# EAGLE board StaticPlatformMain_v1 (EAGLE 9.6.2)
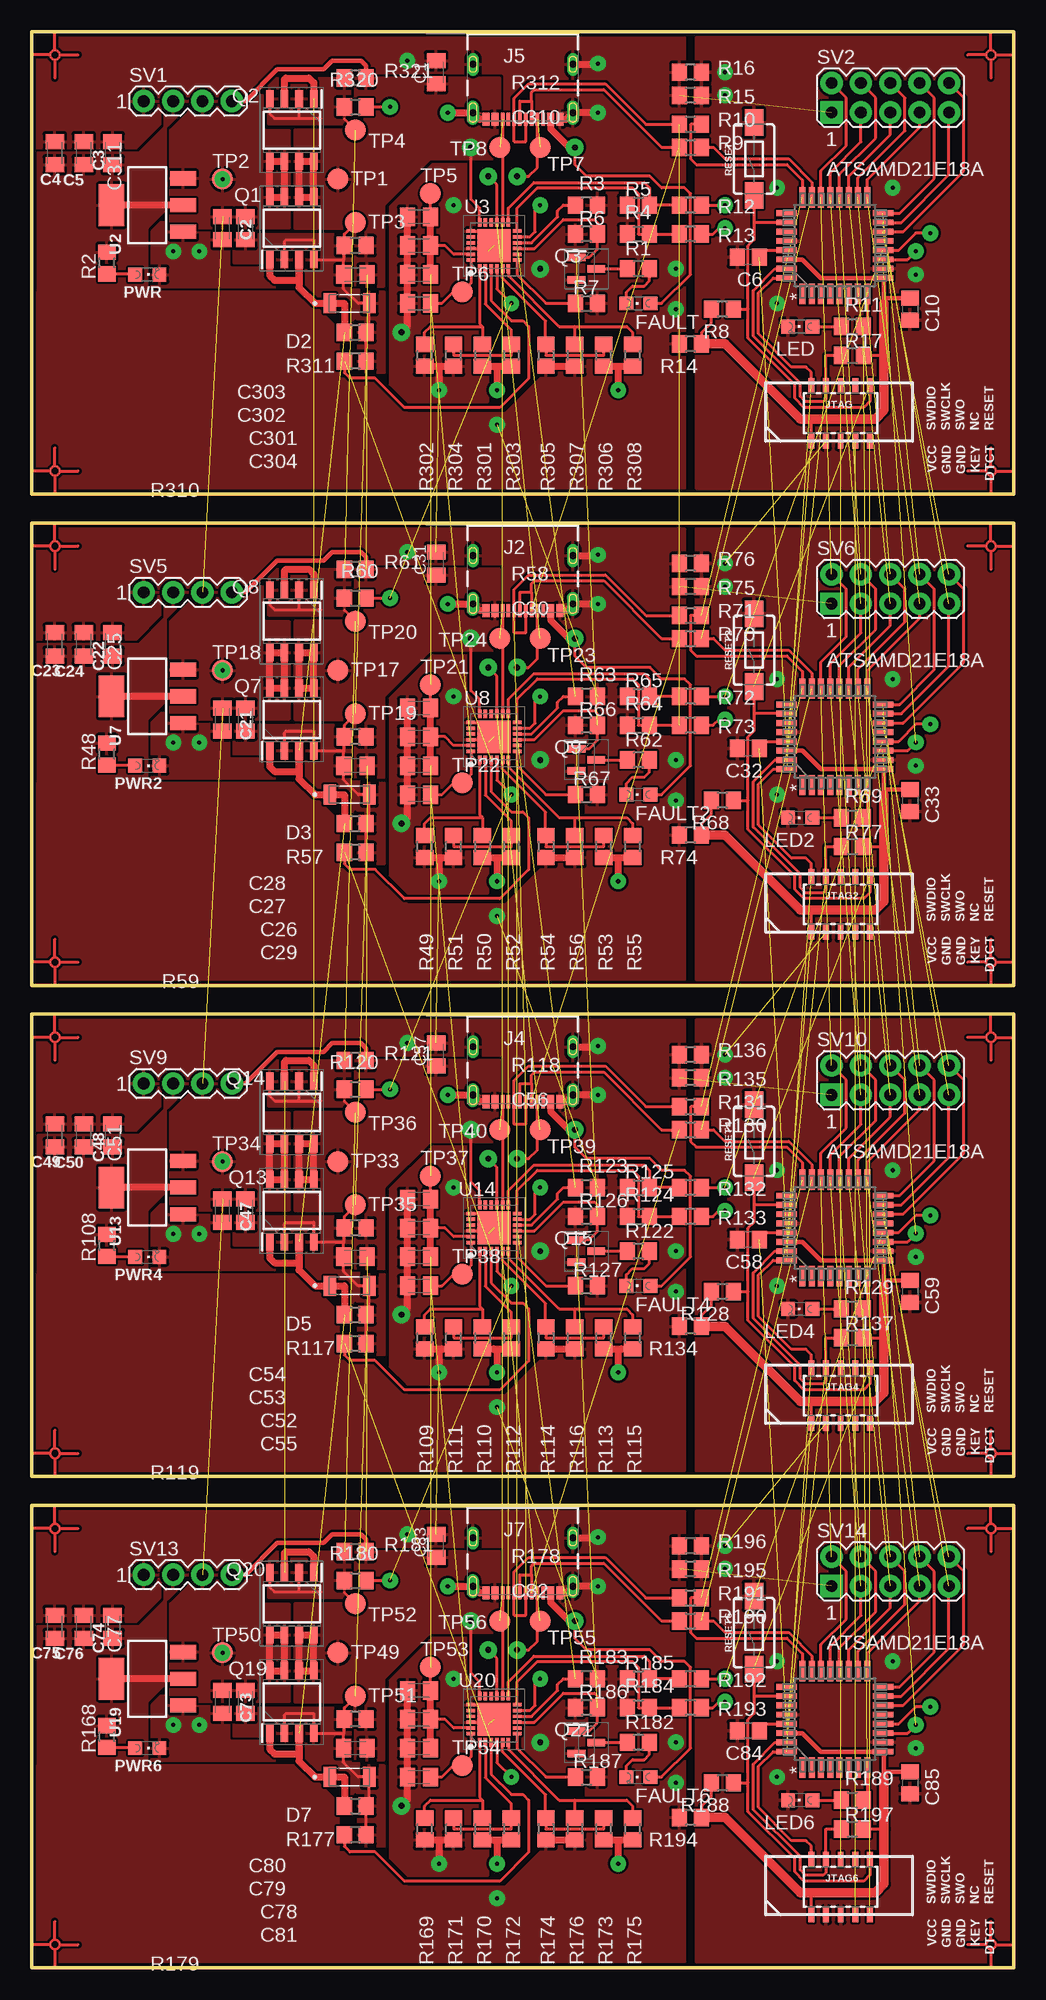
[diagram p7: board, top side]
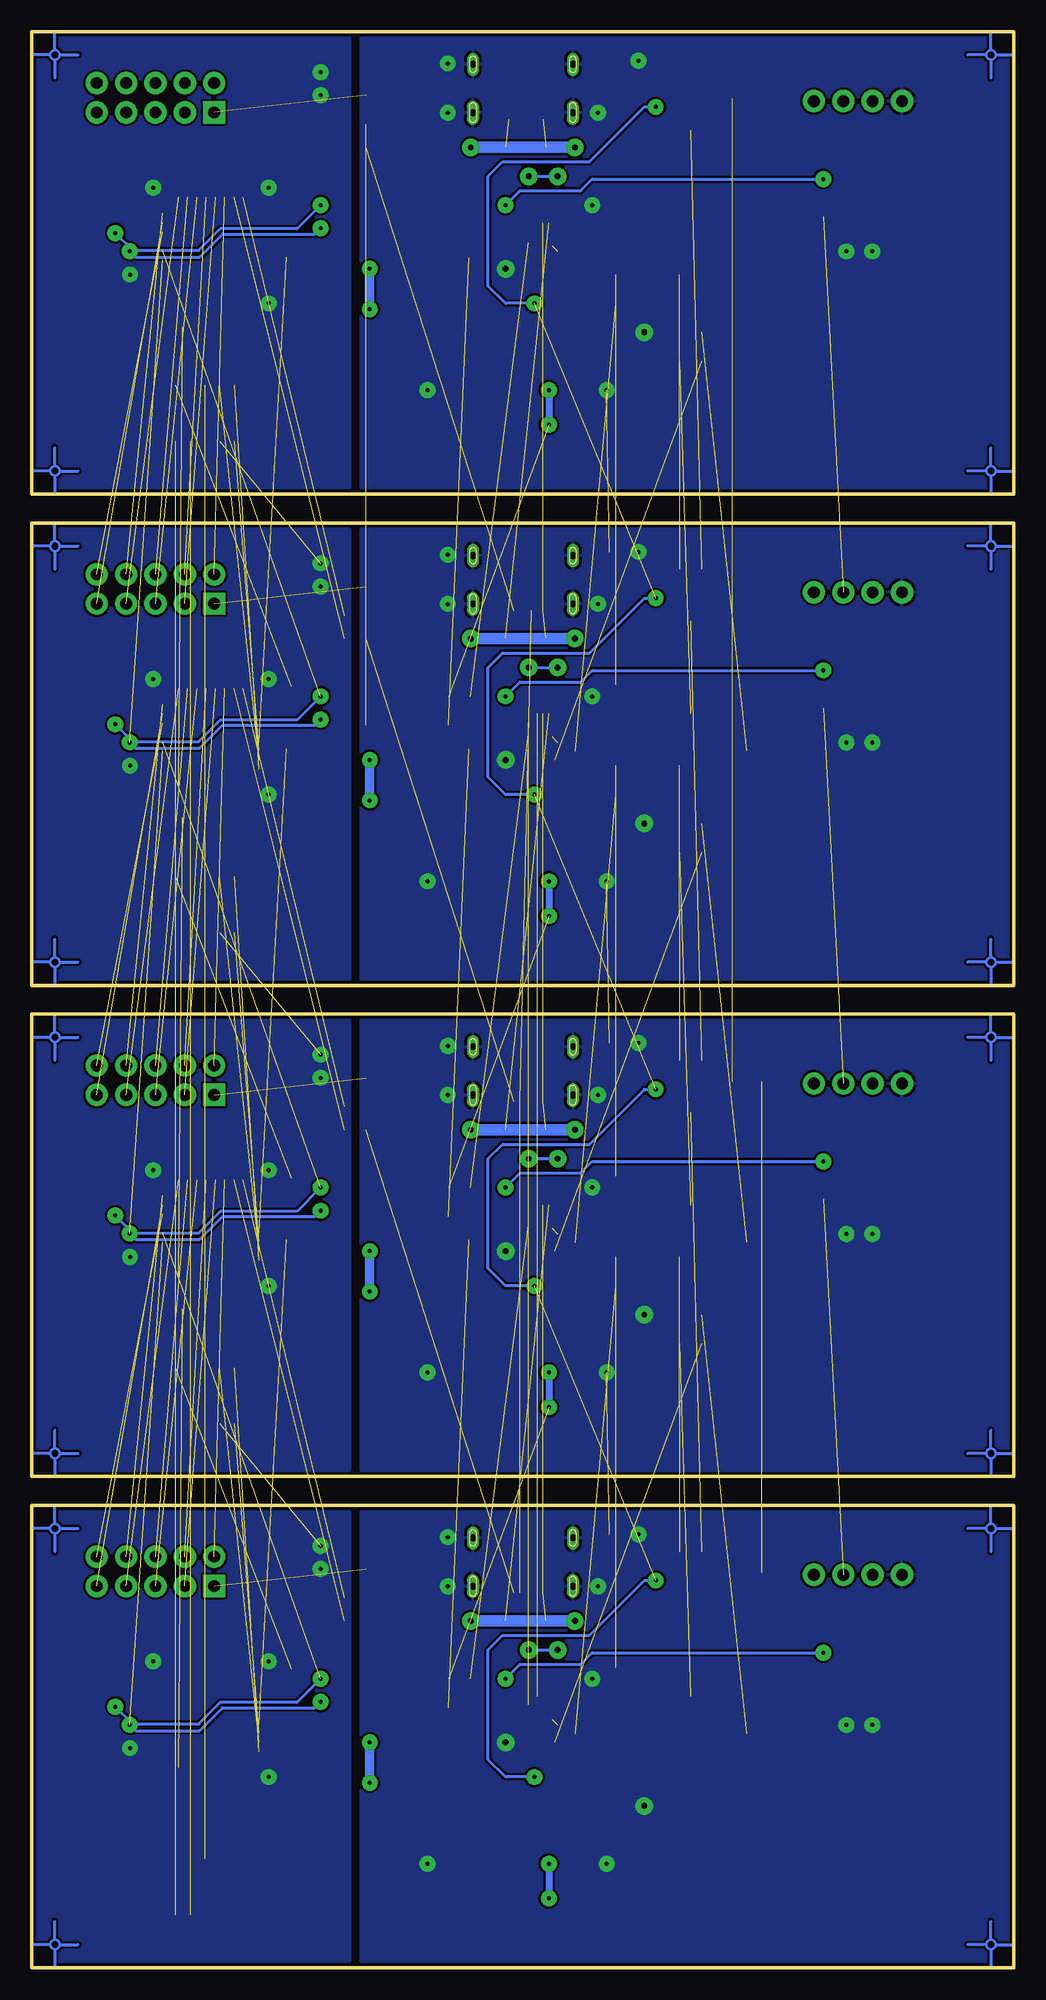
[diagram p8: board, bottom side, seen from below]

Size 85 x 167.5 mm. Coordinates in mm from the lower left corner, seen from the top.
Outline: 0,167.5 85,167.5 85,127.5 0,127.5 0,167.5
Outline: 0,125 85,125 85,85 0,85 0,125
Outline: 0,82.5 85,82.5 85,42.5 0,42.5 0,82.5
Outline: 0,40 85,40 85,0 0,0 0,40
Copper layers (1*16): Top 0.035mm / dielectric 1.5mm / Bottom 0.035mm
Design rules "default *": minimum track width 0.25mm, minimum drill 0.35mm, track to track 0.2mm, track to pad 0.2mm, pad to pad 0.2mm, via to via 0.2mm, smd to smd 0.2mm, copper to edge 0.2mm, drill to drill 0.2mm, minimum pad ring 8mil, minimum via ring 1mm, stop-mask expansion 4mil, vias tented up to drill 0mil, thermal gap 10mil
Net classes: 1 usbpair: width 0.25 mm, clearance 0.2 mm
tRestrict: 8 lines

## Footprints (pad centres in the part's own frame; a part is rotated, then mirrored left to right if it is on the bottom)
C0805K = smd 1.3 x 1.6: 1 -1,0; 2 1,0
C0805 = smd 1.3 x 1.5: 1 -0.95,0; 2 0.95,0
DIOMELF3515N = smd 1.11 x 1.73: A 1.705,0; C -1.705,0
CHIPLED_0805 = smd 1.2 x 1.2: A 0,-1.05; C 0,1.05
GCT_USB4105-GF-A = smd 0.6 x 1.15: A1_B12 -3.2,4.755; A4_B9 -2.4,4.755; B1_A12 3.2,4.755; B4_A9 2.4,4.755 | smd 0.3 x 1.15: A5 -1.25,4.755; A6 -0.25,4.755; A7 0.25,4.755; A8 1.25,4.755; B5 1.75,4.755; B6 0.75,4.755; B7 -0.75,4.755; B8 -1.75,4.755 | drill 0.6 pad 1.05 long: S1 -4.32,4.18; S4 4.32,4.18 | drill 0.6 pad 1 long: S2 -4.32,0; S3 4.32,0
SAMTECH_FTSH-105-01 = smd 0.508 x 1.27: 1 -2.54,-2.413; 2 -2.54,2.413; 3 -1.27,-2.413; 4 -1.27,2.413; 5 0,-2.413; 6 0,2.413; 7 1.27,-2.413; 8 1.27,2.413; 9 2.54,-2.413; 10 2.54,2.413
SOIC127P600X175-8N = smd 1.5 x 0.65: 1 -2.7,1.905; 2 -2.7,0.635; 3 -2.7,-0.635; 4 -2.7,-1.905; 5 2.7,-1.905; 6 2.7,-0.635; 7 2.7,0.635; 8 2.7,1.905
SOT96P240X120-3N = smd 1.55 x 0.65: 1 -0.85,0.96; 2 -0.85,-0.96; 3 0.85,0
R0805 = smd 1.3 x 1.5: 1 -0.95,0; 2 0.95,0
TACTILE_SWITCH_SMD_6.0X3.5MM = smd 2.3 x 1.6: 1 -3.15,0; 2 3.15,0
MA04-1 = drill 1.016 pad 1.93: 1 -3.81,0; 2 -1.27,0; 3 1.27,0; 4 3.81,0
MA05-2 = drill 1.016 pad 1.93 square: 1 -5.08,-1.27 | drill 1.016 pad 1.93: 2 -5.08,1.27; 3 -2.54,-1.27; 4 -2.54,1.27; 5 0,-1.27; 6 0,1.27; 7 2.54,-1.27; 8 2.54,1.27; 9 5.08,-1.27; 10 5.08,1.27
TP18R = smd 1.8 x 1.8: TP 0,0
TQFP32_MC_MCH-M = smd 1.762 x 0.507: 1 -4.169,2.8; 2 -4.169,2; 3 -4.169,1.2; 4 -4.169,0.4; 5 -4.169,-0.4; 6 -4.169,-1.2; 7 -4.169,-2; 8 -4.169,-2.8; 17 4.169,-2.8; 18 4.169,-2; 19 4.169,-1.2; 20 4.169,-0.4; 21 4.169,0.4; 22 4.169,1.2; 23 4.169,2; 24 4.169,2.8 | smd 0.507 x 1.762: 9 -2.8,-4.169; 10 -2,-4.169; 11 -1.2,-4.169; 12 -0.4,-4.169; 13 0.4,-4.169; 14 1.2,-4.169; 15 2,-4.169; 16 2.8,-4.169; 25 2.8,4.169; 26 2,4.169; 27 1.2,4.169; 28 0.4,4.169; 29 -0.4,4.169; 30 -1.2,4.169; 31 -2,4.169; 32 -2.8,4.169
SOT223 = smd 1.219 x 2.235: 1 -2.311,-3.099; 2 0,-3.099; 3 2.311,-3.099 | smd 3.6 x 2.2: 4 0,3.099
QFN50P400X400X60-25N = smd 0.75 x 0.3: 1 -2,1.25; 2 -2,0.75; 3 -2,0.25; 4 -2,-0.25; 5 -2,-0.75; 6 -2,-1.25; 13 2,-1.25; 14 2,-0.75; 15 2,-0.25; 16 2,0.25; 17 2,0.75; 18 2,1.25 | smd 0.3 x 0.75: 7 -1.25,-2; 8 -0.75,-2; 9 -0.25,-2; 10 0.25,-2; 11 0.75,-2; 12 1.25,-2; 19 1.25,2; 20 0.75,2; 21 0.25,2; 22 -0.25,2; 23 -0.75,2; 24 -1.25,2 | smd 2.85 x 2.85: 25 0,0

## Placement (x,y rotation side)
C1  3u3  [C0805K]  35,164 90 top
C2  10u, 6.3V  [C0805K]  16.5,150.5 270 top
C3  4.7u, 6.3V  [C0805K]  7,157 90 top
C4  1u, 6.3V  [C0805K]  2,157 90 top
C5  100n, 6.3V  [C0805K]  4.5,157 90 top
C6  1u, 6.3V  [C0805]  62,148 180 top
C10  10u  [C0805]  76,143.5 270 top
C21  10u, 6.3V  [C0805K]  16.5,108 270 top
C22  4.7u, 6.3V  [C0805K]  7,114.5 90 top
C23  1u, 6.3V  [C0805K]  2,114.5 90 top
C24  100n, 6.3V  [C0805K]  4.5,114.5 90 top
C25  1u  [C0805K]  18.5,108 270 top
C26  1u  [C0805K]  33.5,104 180 top
C27  100n  [C0805K]  33.5,106.5 180 top
C28  100n  [C0805K]  33.5,109 180 top
C29  1u  [C0805K]  33.5,101.5 180 top
C30  1u  [C0805K]  28,104 180 top
C31  3u3  [C0805K]  35,121.5 90 top
C32  1u, 6.3V  [C0805]  62,105.5 180 top
C33  10u  [C0805]  76,101 270 top
C47  10u, 6.3V  [C0805K]  16.5,65.5 270 top
C48  4.7u, 6.3V  [C0805K]  7,72 90 top
C49  1u, 6.3V  [C0805K]  2,72 90 top
C50  100n, 6.3V  [C0805K]  4.5,72 90 top
C51  1u  [C0805K]  18.5,65.5 270 top
C52  1u  [C0805K]  33.5,61.5 180 top
C53  100n  [C0805K]  33.5,64 180 top
C54  100n  [C0805K]  33.5,66.5 180 top
C55  1u  [C0805K]  33.5,59 180 top
C56  1u  [C0805K]  28,61.5 180 top
C57  3u3  [C0805K]  35,79 90 top
C58  1u, 6.3V  [C0805]  62,63 180 top
C59  10u  [C0805]  76,58.5 270 top
C73  10u, 6.3V  [C0805K]  16.5,23 270 top
C74  4.7u, 6.3V  [C0805K]  7,29.5 90 top
C75  1u, 6.3V  [C0805K]  2,29.5 90 top
C76  100n, 6.3V  [C0805K]  4.5,29.5 90 top
C77  1u  [C0805K]  18.5,23 270 top
C78  1u  [C0805K]  33.5,19 180 top
C79  100n  [C0805K]  33.5,21.5 180 top
C80  100n  [C0805K]  33.5,24 180 top
C81  1u  [C0805K]  33.5,16.5 180 top
C82  1u  [C0805K]  28,19 180 top
C83  3u3  [C0805K]  35,36.5 90 top
C84  1u, 6.3V  [C0805]  62,20.5 180 top
C85  10u  [C0805]  76,16 270 top
C301  1u  [C0805K]  33.5,146.5 180 top
C302  100n  [C0805K]  33.5,149 180 top
C303  100n  [C0805K]  33.5,151.5 180 top
C304  1u  [C0805K]  33.5,144 180 top
C310  1u  [C0805K]  28,146.5 180 top
C311  1u  [C0805K]  18.5,150.5 270 top
D2  9V  [DIOMELF3515N]  27.5,144 0 top
D3  9V  [DIOMELF3515N]  27.5,101.5 0 top
D5  9V  [DIOMELF3515N]  27.5,59 0 top
D7  9V  [DIOMELF3515N]  27.5,16.5 0 top
FAULT  GREEN  [CHIPLED_0805]  52.5,144 90 top
FAULT2  GREEN  [CHIPLED_0805]  52.5,101.5 90 top
FAULT4  GREEN  [CHIPLED_0805]  52.5,59 90 top
FAULT6  GREEN  [CHIPLED_0805]  52.5,16.5 90 top
J2  USB4105-GF-A  [GCT_USB4105-GF-A]  42.5,122.18 180 top
J4  USB4105-GF-A  [GCT_USB4105-GF-A]  42.5,79.68 180 top
J5  USB4105-GF-A  [GCT_USB4105-GF-A]  42.5,164.68 180 top
J7  USB4105-GF-A  [GCT_USB4105-GF-A]  42.5,37.18 180 top
JTAG  CORTEX_DEBUG_SMD  [SAMTECH_FTSH-105-01]  70,134.5 0 top
JTAG2  CORTEX_DEBUG_SMD  [SAMTECH_FTSH-105-01]  70,92 0 top
JTAG4  CORTEX_DEBUG_SMD  [SAMTECH_FTSH-105-01]  70,49.5 0 top
JTAG6  CORTEX_DEBUG_SMD  [SAMTECH_FTSH-105-01]  70,7 0 top
LED  RED  [CHIPLED_0805]  66.5,142 90 top
LED2  RED  [CHIPLED_0805]  66.5,99.5 90 top
LED4  RED  [CHIPLED_0805]  66.5,57 90 top
LED6  RED  [CHIPLED_0805]  66.5,14.5 90 top
PWR  GREEN  [CHIPLED_0805]  10,146.5 270 top
PWR2  GREEN  [CHIPLED_0805]  10,104 270 top
PWR4  GREEN  [CHIPLED_0805]  10,61.5 270 top
PWR6  GREEN  [CHIPLED_0805]  10,19 270 top
Q1  DMP3098LSD-13  [SOIC127P600X175-8N]  22.5,150.5 90 top
Q2  DMP3098LSD-13  [SOIC127P600X175-8N]  22.5,159 270 top
Q3  2N7002  [SOT96P240X120-3N]  48,147 0 top
Q7  DMP3098LSD-13  [SOIC127P600X175-8N]  22.5,108 90 top
Q8  DMP3098LSD-13  [SOIC127P600X175-8N]  22.5,116.5 270 top
Q9  2N7002  [SOT96P240X120-3N]  48,104.5 0 top
Q13  DMP3098LSD-13  [SOIC127P600X175-8N]  22.5,65.5 90 top
Q14  DMP3098LSD-13  [SOIC127P600X175-8N]  22.5,74 270 top
Q15  2N7002  [SOT96P240X120-3N]  48,62 0 top
Q19  DMP3098LSD-13  [SOIC127P600X175-8N]  22.5,23 90 top
Q20  DMP3098LSD-13  [SOIC127P600X175-8N]  22.5,31.5 270 top
Q21  2N7002  [SOT96P240X120-3N]  48,19.5 0 top
R1  3k3  [R0805]  52.5,147 180 top
R2  1k  [R0805]  6.5,147.5 90 top
R3  2k2  [R0805]  48,152.5 180 top
R4  2k2  [R0805]  52.5,150 0 top
R5  2k2  [R0805]  52.5,152.5 0 top
R6  22k  [R0805]  48,150 180 top
R7  2k2  [R0805]  48,144 0 top
R8  10k  [R0805]  59.75,143.5 180 top
R9  0  [R0805]  57,157.5 0 top
R10  0  [R0805]  57,159.5 0 top
R11  3k3  [R0805]  71,142 0 top
R12  0  [R0805]  57,152.5 180 top
R13  0  [R0805]  57,150 180 top
R14  0  [R0805]  57,140.5 180 top
R15  0  [R0805]  57,162 180 top
R16  0  [R0805]  57,164 180 top
R17  10k  [R0805]  71,139.5 0 top
R48  1k  [R0805]  6.5,105 90 top
R49  1k  [R0805]  34,97 90 top
R50  5k1  [R0805]  39,97 270 top
R51  1k  [R0805]  36.5,97 90 top
R52  5k1  [R0805]  41.5,97 270 top
R53  1k  [R0805]  49.5,97 90 top
R54  5k1  [R0805]  44.5,97 270 top
R55  0  [R0805]  52,97 90 top
R56  10M  [R0805]  47,97 270 top
R57  1k  [R0805]  28,96.5 180 top
R58  10k  [R0805]  28,106.5 180 top
R59  50k  [R0805]  28,99 0 top
R60  1k  [R0805]  28,118.5 0 top
R61  50k  [R0805]  28,121 180 top
R62  3k3  [R0805]  52.5,104.5 180 top
R63  2k2  [R0805]  48,110 180 top
R64  2k2  [R0805]  52.5,107.5 0 top
R65  2k2  [R0805]  52.5,110 0 top
R66  22k  [R0805]  48,107.5 180 top
R67  2k2  [R0805]  48,101.5 0 top
R68  10k  [R0805]  59.75,101 180 top
R69  3k3  [R0805]  71,99.5 0 top
R70  0  [R0805]  57,115 0 top
R71  0  [R0805]  57,117 0 top
R72  0  [R0805]  57,110 180 top
R73  0  [R0805]  57,107.5 180 top
R74  0  [R0805]  57,98 180 top
R75  0  [R0805]  57,119.5 180 top
R76  0  [R0805]  57,121.5 180 top
R77  10k  [R0805]  71,97 0 top
R108  1k  [R0805]  6.5,62.5 90 top
R109  1k  [R0805]  34,54.5 90 top
R110  5k1  [R0805]  39,54.5 270 top
R111  1k  [R0805]  36.5,54.5 90 top
R112  5k1  [R0805]  41.5,54.5 270 top
R113  1k  [R0805]  49.5,54.5 90 top
R114  5k1  [R0805]  44.5,54.5 270 top
R115  0  [R0805]  52,54.5 90 top
R116  10M  [R0805]  47,54.5 270 top
R117  1k  [R0805]  28,54 180 top
R118  10k  [R0805]  28,64 180 top
R119  50k  [R0805]  28,56.5 0 top
R120  1k  [R0805]  28,76 0 top
R121  50k  [R0805]  28,78.5 180 top
R122  3k3  [R0805]  52.5,62 180 top
R123  2k2  [R0805]  48,67.5 180 top
R124  2k2  [R0805]  52.5,65 0 top
R125  2k2  [R0805]  52.5,67.5 0 top
R126  22k  [R0805]  48,65 180 top
R127  2k2  [R0805]  48,59 0 top
R128  10k  [R0805]  59.75,58.5 180 top
R129  3k3  [R0805]  71,57 0 top
R130  0  [R0805]  57,72.5 0 top
R131  0  [R0805]  57,74.5 0 top
R132  0  [R0805]  57,67.5 180 top
R133  0  [R0805]  57,65 180 top
R134  0  [R0805]  57,55.5 180 top
R135  0  [R0805]  57,77 180 top
R136  0  [R0805]  57,79 180 top
R137  10k  [R0805]  71,54.5 0 top
R168  1k  [R0805]  6.5,20 90 top
R169  1k  [R0805]  34,12 90 top
R170  5k1  [R0805]  39,12 270 top
R171  1k  [R0805]  36.5,12 90 top
R172  5k1  [R0805]  41.5,12 270 top
R173  1k  [R0805]  49.5,12 90 top
R174  5k1  [R0805]  44.5,12 270 top
R175  0  [R0805]  52,12 90 top
R176  10M  [R0805]  47,12 270 top
R177  1k  [R0805]  28,11.5 180 top
R178  10k  [R0805]  28,21.5 180 top
R179  50k  [R0805]  28,14 0 top
R180  1k  [R0805]  28,33.5 0 top
R181  50k  [R0805]  28,36 180 top
R182  3k3  [R0805]  52.5,19.5 180 top
R183  2k2  [R0805]  48,25 180 top
R184  2k2  [R0805]  52.5,22.5 0 top
R185  2k2  [R0805]  52.5,25 0 top
R186  22k  [R0805]  48,22.5 180 top
R187  2k2  [R0805]  48,16.5 0 top
R188  10k  [R0805]  59.75,16 180 top
R189  3k3  [R0805]  71,14.5 0 top
R190  0  [R0805]  57,30 0 top
R191  0  [R0805]  57,32 0 top
R192  0  [R0805]  57,25 180 top
R193  0  [R0805]  57,22.5 180 top
R194  0  [R0805]  57,13 180 top
R195  0  [R0805]  57,34.5 180 top
R196  0  [R0805]  57,36.5 180 top
R197  10k  [R0805]  71,12 0 top
R301  5k1  [R0805]  39,139.5 270 top
R302  1k  [R0805]  34,139.5 90 top
R303  5k1  [R0805]  41.5,139.5 270 top
R304  1k  [R0805]  36.5,139.5 90 top
R305  5k1  [R0805]  44.5,139.5 270 top
R306  1k  [R0805]  49.5,139.5 90 top
R307  10M  [R0805]  47,139.5 270 top
R308  0  [R0805]  52,139.5 90 top
R310  50k  [R0805]  28,141.5 0 top
R311  1k  [R0805]  28,139 180 top
R312  10k  [R0805]  28,149 180 top
R320  1k  [R0805]  28,161 0 top
R321  50k  [R0805]  28,163.5 180 top
RESET  MOMENTARY-SWITCH-SPST-SMD-6.0X3.5MM  [TACTILE_SWITCH_SMD_6.0X3.5MM]  62.5,156.5 90 top
RESET2  MOMENTARY-SWITCH-SPST-SMD-6.0X3.5MM  [TACTILE_SWITCH_SMD_6.0X3.5MM]  62.5,114 90 top
RESET4  MOMENTARY-SWITCH-SPST-SMD-6.0X3.5MM  [TACTILE_SWITCH_SMD_6.0X3.5MM]  62.5,71.5 90 top
RESET6  MOMENTARY-SWITCH-SPST-SMD-6.0X3.5MM  [TACTILE_SWITCH_SMD_6.0X3.5MM]  62.5,29 90 top
SV1  [MA04-1]  13.5,161.5 0 top
SV2  [MA05-2]  74.3,161.79 0 top
SV5  [MA04-1]  13.5,119 0 top
SV6  [MA05-2]  74.3,119.29 0 top
SV9  [MA04-1]  13.5,76.5 0 top
SV10  [MA05-2]  74.3,76.79 0 top
SV13  [MA04-1]  13.5,34 0 top
SV14  [MA05-2]  74.3,34.29 0 top
TP1  TPTP18R  [TP18R]  26.5,154.75 0 top
TP2  TPTP18R  [TP18R]  16.5,154.75 0 top
TP3  TPTP18R  [TP18R]  28,151 0 top
TP4  TPTP18R  [TP18R]  28,159 0 top
TP5  TPTP18R  [TP18R]  34.5,153.5 0 top
TP6  TPTP18R  [TP18R]  37.25,145 0 top
TP7  TPTP18R  [TP18R]  44,157.5 0 top
TP8  TPTP18R  [TP18R]  40.5,157.5 0 top
TP17  TPTP18R  [TP18R]  26.5,112.25 0 top
TP18  TPTP18R  [TP18R]  16.5,112.25 0 top
TP19  TPTP18R  [TP18R]  28,108.5 0 top
TP20  TPTP18R  [TP18R]  28,116.5 0 top
TP21  TPTP18R  [TP18R]  34.5,111 0 top
TP22  TPTP18R  [TP18R]  37.25,102.5 0 top
TP23  TPTP18R  [TP18R]  44,115 0 top
TP24  TPTP18R  [TP18R]  40.5,115 0 top
TP33  TPTP18R  [TP18R]  26.5,69.75 0 top
TP34  TPTP18R  [TP18R]  16.5,69.75 0 top
TP35  TPTP18R  [TP18R]  28,66 0 top
TP36  TPTP18R  [TP18R]  28,74 0 top
TP37  TPTP18R  [TP18R]  34.5,68.5 0 top
TP38  TPTP18R  [TP18R]  37.25,60 0 top
TP39  TPTP18R  [TP18R]  44,72.5 0 top
TP40  TPTP18R  [TP18R]  40.5,72.5 0 top
TP49  TPTP18R  [TP18R]  26.5,27.25 0 top
TP50  TPTP18R  [TP18R]  16.5,27.25 0 top
TP51  TPTP18R  [TP18R]  28,23.5 0 top
TP52  TPTP18R  [TP18R]  28,31.5 0 top
TP53  TPTP18R  [TP18R]  34.5,26 0 top
TP54  TPTP18R  [TP18R]  37.25,17.5 0 top
TP55  TPTP18R  [TP18R]  44,30 0 top
TP56  TPTP18R  [TP18R]  40.5,30 0 top
U1  ATSAMD21E18A  [TQFP32_MC_MCH-M]  69.5,149 90 top
U2  AMS1117  [SOT223]  10,152.5 90 top
U3  CYPD3177-24LQXQT  [QFN50P400X400X60-25N]  40,149 90 top
U7  AMS1117  [SOT223]  10,110 90 top
U8  CYPD3177-24LQXQT  [QFN50P400X400X60-25N]  40,106.5 90 top
U9  ATSAMD21E18A  [TQFP32_MC_MCH-M]  69.5,106.5 90 top
U13  AMS1117  [SOT223]  10,67.5 90 top
U14  CYPD3177-24LQXQT  [QFN50P400X400X60-25N]  40,64 90 top
U15  ATSAMD21E18A  [TQFP32_MC_MCH-M]  69.5,64 90 top
U19  AMS1117  [SOT223]  10,25 90 top
U20  CYPD3177-24LQXQT  [QFN50P400X400X60-25N]  40,21.5 90 top
U21  ATSAMD21E18A  [TQFP32_MC_MCH-M]  69.5,21.5 90 top

## Tracks (layer width: path | path; a pad name or v marks a point on that pad's centre or on a via)
3V3  (via drill 0.35)  (3 unrouted)
  Top 0.61: R301.2 40,138.55 | 40,138.55 R303.2 | 40,138.55 40.25,138.3 v40.25,136.5 | R305.2 R307.2 | U2.2 U2.4 | R50.2 40,96.05 | 40,96.05 R52.2 | 40,96.05 40.25,95.8 v40.25,94 | R54.2 R56.2 | U7.2 U7.4 | R110.2 40,53.55 | 40,53.55 R112.2 | 40,53.55 40.25,53.3 v40.25,51.5 | R114.2 R116.2 | U13.2 U13.4 | R170.2 40,11.05 | 40,11.05 R172.2 | 40,11.05 40.25,10.8 v40.25,9 | R174.2 R176.2 | U19.2 U19.4
  Bottom 0.61: v40.25,136.5 v40.25,133.5 | v40.25,94 v40.25,91 | v40.25,51.5 v40.25,48.5 | v40.25,9 v40.25,6
  Bottom 0.813: v55.75,143.5 v55.75,147 | v55.75,101 v55.75,104.5 | v55.75,58.5 v55.75,62 | v55.75,16 v55.75,19.5
  pour Top (rank 2): 11.5,162 11.5,159.25 9.25,157 0.5,157 0.5,141.5 10,141.5 10,150.5 14.5,155 14.5,162
  pour Top (rank 2): 0.5,145 23.25,145 26.5,141.75 26.5,137.5 29.5,137.5 32.5,134.5 41,134.5 44.5,138 48,138 48,149 56.5,149 56.5,128 0.5,128
  pour Top (rank 2): 48,154.5 48,148.5 52.5,148.5 52.5,154.5
  pour Top (rank 2): 11.5,119.5 11.5,116.75 9.25,114.5 0.5,114.5 0.5,99 10,99 10,108 14.5,112.5 14.5,119.5
  pour Top (rank 2): 0.5,102.5 23.25,102.5 26.5,99.25 26.5,95 29.5,95 32.5,92 41,92 44.5,95.5 48,95.5 48,106.5 56.5,106.5 56.5,85.5 0.5,85.5
  pour Top (rank 2): 48,112 48,106 52.5,106 52.5,112
  pour Top (rank 2): 11.5,77 11.5,74.25 9.25,72 0.5,72 0.5,56.5 10,56.5 10,65.5 14.5,70 14.5,77
  pour Top (rank 2): 0.5,60 23.25,60 26.5,56.75 26.5,52.5 29.5,52.5 32.5,49.5 41,49.5 44.5,53 48,53 48,64 56.5,64 56.5,43 0.5,43
  pour Top (rank 2): 48,69.5 48,63.5 52.5,63.5 52.5,69.5
  pour Top (rank 2): 11.5,34.5 11.5,31.75 9.25,29.5 0.5,29.5 0.5,14 10,14 10,23 14.5,27.5 14.5,34.5
  pour Top (rank 2): 0.5,17.5 23.25,17.5 26.5,14.25 26.5,10 29.5,10 32.5,7 41,7 44.5,10.5 48,10.5 48,21.5 56.5,21.5 56.5,0.5 0.5,0.5
  pour Top (rank 2): 48,27 48,21 52.5,21 52.5,27
_3V3  (3 unrouted)
  Top 0.25: 73.75,146.12 U1.9 | R17.2 73.75,139.5 | R14.1 58,140.55 58,141.5 58.8,142.3 R8.2 | JTAG.1 67.46,133.96 67.5,134 | 73.75,103.62 U9.9 | R77.2 73.75,97 | R74.1 58,98.05 58,99 58.8,99.8 R68.2 | JTAG2.1 67.46,91.46 67.5,91.5 | 73.75,61.12 U15.9 | R137.2 73.75,54.5 | R134.1 58,55.55 58,56.5 58.8,57.3 R128.2 | JTAG4.1 67.46,48.96 67.5,49 | 73.75,18.62 U21.9 | R197.2 73.75,12 | R194.1 58,13.05 58,14 58.8,14.8 R188.2 | JTAG6.1 67.46,6.46 67.5,6.5
  Top 0.406: U1.9 68.3,146.2 66.7,147.8 U1.30 | 73.75,144 73.75,144.5 | 73.75,144.5 73.75,146.12 | C10.1 73.8,144.45 73.75,144.5 | U9.9 68.3,103.7 66.7,105.3 U9.30 | 73.75,101.5 73.75,102 | 73.75,102 73.75,103.62 | C33.1 73.8,101.95 73.75,102 | U15.9 68.3,61.2 66.7,62.8 U15.30 | 73.75,59 73.75,59.5 | 73.75,59.5 73.75,61.12 | C59.1 73.8,59.45 73.75,59.5 | U21.9 68.3,18.7 66.7,20.3 U21.30 | 73.75,16.5 73.75,17 | 73.75,17 73.75,18.62 | C85.1 73.8,16.95 73.75,17
  Top 0.813: R14.1 60,140.5 66.5,134 67.5,134 73,134 73.75,134.75 73.75,139.5 73.75,144 | R74.1 60,98 66.5,91.5 67.5,91.5 73,91.5 73.75,92.25 73.75,97 73.75,101.5 | R134.1 60,55.5 66.5,49 67.5,49 73,49 73.75,49.75 73.75,54.5 73.75,59 | R194.1 60,13 66.5,6.5 67.5,6.5 73,6.5 73.75,7.25 73.75,12 73.75,16.5
_GND  (via drill 0.35)  (3 unrouted)
  other vias: 60,164 60,162 64.5,154 64.5,144 76.5,146.5 74.5,154 60,121.5 60,119.5 64.5,111.5 64.5,101.5 76.5,104 74.5,111.5 60,79 60,77 64.5,69 64.5,59 76.5,61.5 74.5,69 60,36.5 60,34.5 64.5,26.5 64.5,16.5 76.5,19 74.5,26.5
  pour Top (rank 4): 57.5,167 57.5,128 84.5,128 84.5,167
  pour Bottom (rank 4): 57.5,167 57.5,128 84.5,128 84.5,167
  pour Top (rank 4): 57.5,124.5 57.5,85.5 84.5,85.5 84.5,124.5
  pour Bottom (rank 4): 57.5,124.5 57.5,85.5 84.5,85.5 84.5,124.5
  pour Top (rank 4): 57.5,82 57.5,43 84.5,43 84.5,82
  pour Bottom (rank 4): 57.5,82 57.5,43 84.5,43 84.5,82
  pour Top (rank 4): 57.5,39.5 57.5,0.5 84.5,0.5 84.5,39.5
  pour Bottom (rank 4): 57.5,39.5 57.5,0.5 84.5,0.5 84.5,39.5
_SCL  (via drill 0.35)  (3 unrouted)
  Top 0.25: R12.1 v60,152.5 | v77.77,150.08 76.5,150.08 75.02,148.6 U1.12 | R72.1 v60,110 | v77.77,107.58 76.5,107.58 75.02,106.1 U9.12 | R132.1 v60,67.5 | v77.77,65.08 76.5,65.08 75.02,63.6 U15.12 | R192.1 v60,25 | v77.77,22.58 76.5,22.58 75.02,21.1 U21.12
  Bottom 0.25: v60,152.5 62.05,150.45 68.69,150.45 70.55,148.58 76.27,148.58 v77.77,150.08 | v60,110 62.05,107.95 68.69,107.95 70.55,106.08 76.27,106.08 v77.77,107.58 | v60,67.5 62.05,65.45 68.69,65.45 70.55,63.58 76.27,63.58 v77.77,65.08 | v60,25 62.05,22.95 68.69,22.95 70.55,21.08 76.27,21.08 v77.77,22.58
_SDA  (via drill 0.35)  (3 unrouted)
  Top 0.25: v60,150.5 59.45,150.5 58.95,150 R13.1 | U1.11 75.8,147.8 v76.52,148.52 | v60,108 59.45,108 58.95,107.5 R73.1 | U9.11 75.8,105.3 v76.52,106.02 | v60,65.5 59.45,65.5 58.95,65 R133.1 | U15.11 75.8,62.8 v76.52,63.52 | v60,23 59.45,23 58.95,22.5 R193.1 | U21.11 75.8,20.3 v76.52,21.02
  Bottom 0.25: v60,150.5 60.5,150 68.5,150 70.48,148.02 76.02,148.02 v76.52,148.52 | v60,108 60.5,107.5 68.5,107.5 70.48,105.52 76.02,105.52 v76.52,106.02 | v60,65.5 60.5,65 68.5,65 70.48,63.02 76.02,63.02 v76.52,63.52 | v60,23 60.5,22.5 68.5,22.5 70.48,20.52 76.02,20.52 v76.52,21.02
_USB_D_N  (3 unrouted)
  Top 0.25: R9.2 59,157.5 60,156.5 65.5,156.5 67.5,154.5 U1.23 | R70.2 59,115 60,114 65.5,114 67.5,112 U9.23 | R130.2 59,72.5 60,71.5 65.5,71.5 67.5,69.5 U15.23 | R190.2 59,30 60,29 65.5,29 67.5,27 U21.23
_USB_D_P  (3 unrouted)
  Top 0.25: R10.2 57.02,159.5 57,159.47 57,156.5 57.5,156 65.36,156 66.7,154.66 U1.24 | R71.2 57.02,117 57,116.97 57,114 57.5,113.5 65.36,113.5 66.7,112.16 U9.24 | R131.2 57.02,74.5 57,74.47 57,71.5 57.5,71 65.36,71 66.7,69.66 U15.24 | R191.2 57.02,32 57,31.97 57,29 57.5,28.5 65.36,28.5 66.7,27.16 U21.24
CC1  (via drill 0.5)  (7 unrouted)
  Top 0.25: U3.15 40.25,154.25 v39.5,155 | v42,155 43,155 43.75,155.75 J5.A5 | U8.15 40.25,111.75 v39.5,112.5 | v42,112.5 43,112.5 43.75,113.25 J2.A5 | U14.15 40.25,69.25 v39.5,70 | v42,70 43,70 43.75,70.75 J4.A5 | U20.15 40.25,26.75 v39.5,27.5 | v42,27.5 43,27.5 43.75,28.25 J7.A5
  Bottom 0.25: v42,155 v39.5,155 | v42,112.5 v39.5,112.5 | v42,70 v39.5,70 | v42,27.5 v39.5,27.5
CC2  (7 unrouted)
  Top 0.25: J5.B5 U3.14 | J2.B5 U8.14 | J4.B5 U14.14 | J7.B5 U20.14
DTCT  (3 unrouted)
FAULT  (3 unrouted)
  Top 0.25: U3.9 43.5,148.75 46,151.25 48.7,151.25 48.95,151 R6.1 48.95,148.7 48.25,148 47.19,148 Q3.1 | U8.9 43.5,106.25 46,108.75 48.7,108.75 48.95,108.5 R66.1 48.95,106.2 48.25,105.5 47.19,105.5 Q9.1 | U14.9 43.5,63.75 46,66.25 48.7,66.25 48.95,66 R126.1 48.95,63.7 48.25,63 47.19,63 Q15.1 | U20.9 43.5,21.25 46,23.75 48.7,23.75 48.95,23.5 R186.1 48.95,21.2 48.25,20.5 47.19,20.5 Q21.1
FLIP  (3 unrouted)
  Top 0.25: U3.10 43.25,149.25 45.5,151.5 45.5,152 46,152.5 R3.2 | U8.10 43.25,106.75 45.5,109 45.5,109.5 46,110 R63.2 | U14.10 43.25,64.25 45.5,66.5 45.5,67 46,67.5 R123.2 | U20.10 43.25,21.75 45.5,24 45.5,24.5 46,25 R183.2
G1G2  (3 unrouted)
  Top 0.25: Q1.2 21.86,149.37 22,149.5 24.41,149.5 Q1.4 26.95,147.8 27,147.75 | R311.1 R310.2 29.2,141.75 D2.A 28.25,144 27,145.25 C310.2 27,147.75 | 27,147.75 27,148.95 R312.2 27.05,150 28,150.95 TP3.TP | Q7.2 21.86,106.86 22,107 24.41,107 Q7.4 26.95,105.3 27,105.25 | R57.1 R59.2 29.2,99.25 D3.A 28.25,101.5 27,102.75 C30.2 27,105.25 | 27,105.25 27,106.45 R58.2 27.05,107.5 28,108.45 TP19.TP | Q13.2 21.86,64.37 22,64.5 24.41,64.5 Q13.4 26.95,62.8 27,62.75 | R117.1 R119.2 29.2,56.75 D5.A 28.25,59 27,60.25 C56.2 27,62.75 | 27,62.75 27,63.95 R118.2 27.05,65 28,65.95 TP35.TP | Q19.2 21.86,21.86 22,22 24.41,22 Q19.4 26.95,20.3 27,20.25 | R177.1 R179.2 29.2,14.25 D7.A 28.25,16.5 27,17.75 C82.2 27,20.25 | 27,20.25 27,21.45 R178.2 27.05,22.5 28,23.45 TP51.TP
  pour Top (rank 2): 30.5,145 30.5,138 28,138 28,141 21.5,147.5 17.5,147.5 17.5,150 28,150 28,145.5 28.5,145
  pour Top (rank 2): 30.5,102.5 30.5,95.5 28,95.5 28,98.5 21.5,105 17.5,105 17.5,107.5 28,107.5 28,103 28.5,102.5
  pour Top (rank 2): 30.5,60 30.5,53 28,53 28,56 21.5,62.5 17.5,62.5 17.5,65 28,65 28,60.5 28.5,60
  pour Top (rank 2): 30.5,17.5 30.5,10.5 28,10.5 28,13.5 21.5,20 17.5,20 17.5,22.5 28,22.5 28,18 28.5,17.5
G3G4  (3 unrouted)
  Top 0.25: Q2.4 20.59,160.41 21,160 23,160 | 23,160 23.14,160.13 Q2.2 | 23,160 25,160 | TP4.TP 27.05,159.95 | Q8.4 20.59,117.91 21,117.5 23,117.5 | 23,117.5 23.14,117.64 Q8.2 | 23,117.5 25,117.5 | TP20.TP 27.05,117.45 | Q14.4 20.59,75.41 21,75 23,75 | 23,75 23.14,75.13 Q14.2 | 23,75 25,75 | TP36.TP 27.05,74.95 | Q20.4 20.59,32.91 21,32.5 23,32.5 | 23,32.5 23.14,32.64 Q20.2 | 23,32.5 25,32.5 | TP52.TP 27.05,32.45
  pour Top (rank 2): 27.5,163.5 27.5,159.5 20.5,159.5 20.5,163.5
  pour Top (rank 2): 27.5,121 27.5,117 20.5,117 20.5,121
  pour Top (rank 2): 27.5,78.5 27.5,74.5 20.5,74.5 20.5,78.5
  pour Top (rank 2): 27.5,36 27.5,32 20.5,32 20.5,36
GND  (via drill 0.35, 0.5)  (11 unrouted)
  Top 0.25: U3.22 39.25,148.75 39.5,148.5 | U3.19 38.75,150.25 39,150 | U8.22 39.25,106.25 39.5,106 | U8.19 38.75,107.75 39,107.5 | U14.22 39.25,63.75 39.5,63.5 | U14.19 38.75,65.25 39,65 | U20.22 39.25,21.25 39.5,21 | U20.19 38.75,22.75 39,22.5
  Top 0.61: C303.2 C302.2 C301.2 C304.2 32.5,142 v32,141.5 | R302.1 35.5,138.55 | 35.5,138.55 R304.1 | 35.5,138.55 35.25,138.3 v35.25,136.5 | R306.1 51,138.55 | 51,138.55 R308.1 | 51,138.55 50.75,138.3 v50.75,136.5 | v36,160.5 J5.S4 38.76,159.93 J5.B1_A12 | v49,160.5 J5.S1 46.24,159.93 J5.A1_B12 | J5.S2 48.93,164.68 v49,164.75 | C28.2 C27.2 C26.2 C29.2 32.5,99.5 v32,99 | R49.1 35.5,96.05 | 35.5,96.05 R51.1 | 35.5,96.05 35.25,95.8 v35.25,94 | R53.1 51,96.05 | 51,96.05 R55.1 | 51,96.05 50.75,95.8 v50.75,94 | v36,118 J2.S4 38.76,117.43 J2.B1_A12 | v49,118 J2.S1 46.24,117.43 J2.A1_B12 | J2.S2 48.93,122.18 v49,122.25 | C54.2 C53.2 C52.2 C55.2 32.5,57 v32,56.5 | R109.1 35.5,53.55 | 35.5,53.55 R111.1 | 35.5,53.55 35.25,53.3 v35.25,51.5 | R113.1 51,53.55 | 51,53.55 R115.1 | 51,53.55 50.75,53.3 v50.75,51.5 | v36,75.5 J4.S4 38.76,74.93 J4.B1_A12 | v49,75.5 J4.S1 46.24,74.93 J4.A1_B12 | J4.S2 48.93,79.68 v49,79.75 | C80.2 C79.2 C78.2 C81.2 32.5,14.5 v32,14 | R169.1 35.5,11.05 | 35.5,11.05 R171.1 | 35.5,11.05 35.25,10.8 v35.25,9 | R173.1 51,11.05 | 51,11.05 R175.1 | 51,11.05 50.75,10.8 v50.75,9 | v36,33 J7.S4 38.76,32.43 J7.B1_A12 | v49,33 J7.S1 46.24,32.43 J7.A1_B12 | J7.S2 48.93,37.18 v49,37.25
  other vias: 14.5,148.5 12.25,148.5 44,147 36.5,152.5 32.5,165 14.5,106 12.25,106 44,104.5 36.5,110 32.5,122.5 14.5,63.5 12.25,63.5 44,62 36.5,67.5 32.5,80 14.5,21 12.25,21 44,19.5 36.5,25 32.5,37.5
  pour Top (rank 3): 39.5,156 34.5,156 31,152.5 31,137 32.5,135.5 39.5,135.5
  pour Top (rank 3): 48,144 44.5,144 42.5,146 42.5,148 46,151.5 48,151.5
  pour Top (rank 3): 56.5,154.5 0.5,154.5 0.5,167 56.5,167
  pour Top (rank 3): 10,151 10,144.5 21,144.5 21,147 17,151
  pour Bottom (rank 4): 0.5,167 0.5,128 56.5,128 56.5,167
  pour Top (rank 3): 39.5,113.5 34.5,113.5 31,110 31,94.5 32.5,93 39.5,93
  pour Top (rank 3): 48,101.5 44.5,101.5 42.5,103.5 42.5,105.5 46,109 48,109
  pour Top (rank 3): 56.5,112 0.5,112 0.5,124.5 56.5,124.5
  pour Top (rank 3): 10,108.5 10,102 21,102 21,104.5 17,108.5
  pour Bottom (rank 4): 0.5,124.5 0.5,85.5 56.5,85.5 56.5,124.5
  pour Top (rank 3): 39.5,71 34.5,71 31,67.5 31,52 32.5,50.5 39.5,50.5
  pour Top (rank 3): 48,59 44.5,59 42.5,61 42.5,63 46,66.5 48,66.5
  pour Top (rank 3): 56.5,69.5 0.5,69.5 0.5,82 56.5,82
  pour Top (rank 3): 10,66 10,59.5 21,59.5 21,62 17,66
  pour Bottom (rank 4): 0.5,82 0.5,43 56.5,43 56.5,82
  pour Top (rank 3): 39.5,28.5 34.5,28.5 31,25 31,9.5 32.5,8 39.5,8
  pour Top (rank 3): 48,16.5 44.5,16.5 42.5,18.5 42.5,20.5 46,24 48,24
  pour Top (rank 3): 56.5,27 0.5,27 0.5,39.5 56.5,39.5
  pour Top (rank 3): 10,23.5 10,17 21,17 21,19.5 17,23.5
  pour Bottom (rank 4): 0.5,39.5 0.5,0.5 56.5,0.5 56.5,39.5
KEY  (3 unrouted)
LED  (3 unrouted)
  Top 0.25: U1.8 72.3,142.35 R11.2 | U9.8 72.3,99.85 R69.2 | U15.8 72.3,57.35 R129.2 | U21.8 72.3,14.85 R189.2
LED_GP
  Top 0.25: LED.A R11.1
LED_GP2
  Top 0.25: LED2.A R69.1
LED_GP4
  Top 0.25: LED4.A R129.1
LED_GP6
  Top 0.25: LED6.A R189.1
LED_PWR
  Top 0.25: R2.1 8.9,146.55 PWR.A
LED_PWR2
  Top 0.25: R48.1 8.9,104.05 PWR2.A
LED_PWR4
  Top 0.25: R108.1 8.9,61.55 PWR4.A
LED_PWR6
  Top 0.25: R168.1 8.9,19.05 PWR6.A
N$1
  Top 0.25: FAULT.C 51.45,144.95 52,145.5 53,145.5 53.45,145.95 R1.1
N$2
  Top 0.25: R7.1 44.5,144 42,146.5 U3.7
N$3
  Top 0.25: U3.1 38.75,142.25 39,142 | 39,142 R301.1 | R302.2 34,141.5 34.5,142 39,142
N$4
  Top 0.25: U3.2 39.25,143.95 41.5,141.7 R303.1 41.5,139.5 36.5,139.5 R304.2
N$5
  Top 0.25: U3.5 40.75,146.2 44.48,142.47 44.48,140.47 R305.1 44.5,139.5 49.5,139.5 R306.2
N$6
  Bottom 0.25: 2,166 2,167.5
N$7
  Top 0.25: Q3.3 R1.2
N$8
  Bottom 0.25: 2.5,165.5 4,165.5
N$10
  Top 0.25: U3.6 41.25,146.39 45.64,142 47,142 | 47,142 51.5,142 52,141.5 R308.2 | R307.1 47,142
N$11
  Bottom 0.25: 2,165 2,163.5
N$12
  Bottom 0.25: 1.5,165.5 0,165.5
N$13
  Bottom 0.25: 2,130 2,131.5
N$14
  Top 0.25: 2,166 2,167.5
N$15
  Top 0.25: 1.5,165.5 0,165.5
N$16
  Top 0.25: 2,165 2,163.5
N$17
  Top 0.25: 2.5,165.5 4,165.5
N$18
  Top 0.25: 83,166 83,167.5
N$20
  Top 0.25: 82.5,165.5 81,165.5
N$21
  Top 0.25: 83,165 83,163.5
N$22
  Top 0.25: 83.5,165.5 85,165.5
N$23
  Top 0.25: 83,130 83,131.5
N$25
  Bottom 0.25: 2.5,129.5 4,129.5
N$26
  Bottom 0.25: 2,129 2,127.5
N$27
  Bottom 0.25: 1.5,129.5 0,129.5
N$29
  Top 0.25: 82.5,129.5 81,129.5
N$30
  Top 0.25: 83,129 83,127.5
N$31
  Top 0.25: 83.5,129.5 85,129.5
N$32
  Top 0.25: 2,130 2,131.5
N$33
  Top 0.25: 1.5,129.5 0,129.5
N$34
  Top 0.25: 2,129 2,127.5
N$35
  Top 0.25: 2.5,129.5 4,129.5
N$36
  Bottom 0.25: 83,130 83,131.5
N$37
  Bottom 0.25: 83.5,129.5 85,129.5
N$38
  Bottom 0.25: 83,129 83,127.5
N$39
  Bottom 0.25: 82.5,129.5 81,129.5
N$44
  Bottom 0.25: 83,166 83,167.5
N$45
  Bottom 0.25: 83.5,165.5 85,165.5
N$46
  Bottom 0.25: 83,165 83,163.5
N$47
  Bottom 0.25: 82.5,165.5 81,165.5
N$89
  Top 0.25: U8.1 38.75,99.75 39,99.5 | 39,99.5 R50.1 | R49.2 34,99 34.5,99.5 39,99.5
N$90
  Top 0.25: U8.2 39.25,101.45 41.5,99.2 R52.1 41.5,97 36.5,97 R51.2
N$91
  Top 0.25: U8.5 40.75,103.7 44.48,99.97 44.48,97.97 R54.1 44.5,97 49.5,97 R53.2
N$92
  Top 0.25: U8.6 41.25,103.89 45.64,99.5 47,99.5 | 47,99.5 51.5,99.5 52,99 R55.2 | R56.1 47,99.5
N$93
  Top 0.25: FAULT2.C 51.45,102.45 52,103 53,103 53.45,103.45 R62.1
N$94
  Top 0.25: Q9.3 R62.2
N$95
  Top 0.25: R67.1 44.5,101.5 42,104 U8.7
N$98
  Top 0.25: 2,123.5 2,125
N$99
  Top 0.25: 1.5,123 0,123
N$100
  Top 0.25: 2,122.5 2,121
N$101
  Top 0.25: 2.5,123 4,123
N$102
  Top 0.25: 83,123.5 83,125
N$103
  Top 0.25: 82.5,123 81,123
N$104
  Top 0.25: 83,122.5 83,121
N$105
  Top 0.25: 83.5,123 85,123
N$106
  Top 0.25: 83,87.5 83,89
N$107
  Top 0.25: 82.5,87 81,87
N$108
  Top 0.25: 83,86.5 83,85
N$109
  Top 0.25: 83.5,87 85,87
N$110
  Top 0.25: 2,87.5 2,89
N$111
  Top 0.25: 1.5,87 0,87
N$112
  Top 0.25: 2,86.5 2,85
N$113
  Top 0.25: 2.5,87 4,87
N$114
  Bottom 0.25: 2,123.5 2,125
N$115
  Bottom 0.25: 2.5,123 4,123
N$116
  Bottom 0.25: 2,122.5 2,121
N$117
  Bottom 0.25: 1.5,123 0,123
N$118
  Bottom 0.25: 2,87.5 2,89
N$119
  Bottom 0.25: 2.5,87 4,87
N$120
  Bottom 0.25: 2,86.5 2,85
N$121
  Bottom 0.25: 1.5,87 0,87
N$122
  Bottom 0.25: 83,87.5 83,89
N$123
  Bottom 0.25: 83.5,87 85,87
N$124
  Bottom 0.25: 83,86.5 83,85
N$125
  Bottom 0.25: 82.5,87 81,87
N$126
  Bottom 0.25: 83,123.5 83,125
N$127
  Bottom 0.25: 83.5,123 85,123
N$128
  Bottom 0.25: 83,122.5 83,121
N$129
  Bottom 0.25: 82.5,123 81,123
N$175
  Top 0.25: U14.1 38.75,57.25 39,57 | 39,57 R110.1 | R109.2 34,56.5 34.5,57 39,57
N$176
  Top 0.25: U14.2 39.25,58.95 41.5,56.7 R112.1 41.5,54.5 36.5,54.5 R111.2
N$177
  Top 0.25: U14.5 40.75,61.2 44.48,57.47 44.48,55.47 R114.1 44.5,54.5 49.5,54.5 R113.2
N$178
  Top 0.25: U14.6 41.25,61.39 45.64,57 47,57 | 47,57 51.5,57 52,56.5 R115.2 | R116.1 47,57
N$179
  Top 0.25: FAULT4.C 51.45,59.95 52,60.5 53,60.5 53.45,60.95 R122.1
N$180
  Top 0.25: Q15.3 R122.2
N$181
  Top 0.25: R127.1 44.5,59 42,61.5 U14.7
N$184
  Top 0.25: 2,81 2,82.5
N$185
  Top 0.25: 1.5,80.5 0,80.5
N$186
  Top 0.25: 2,80 2,78.5
N$187
  Top 0.25: 2.5,80.5 4,80.5
N$188
  Top 0.25: 83,81 83,82.5
N$189
  Top 0.25: 82.5,80.5 81,80.5
N$190
  Top 0.25: 83,80 83,78.5
N$191
  Top 0.25: 83.5,80.5 85,80.5
N$192
  Top 0.25: 83,45 83,46.5
N$193
  Top 0.25: 82.5,44.5 81,44.5
N$194
  Top 0.25: 83,44 83,42.5
N$195
  Top 0.25: 83.5,44.5 85,44.5
N$196
  Top 0.25: 2,45 2,46.5
N$197
  Top 0.25: 1.5,44.5 0,44.5
N$198
  Top 0.25: 2,44 2,42.5
N$199
  Top 0.25: 2.5,44.5 4,44.5
N$200
  Bottom 0.25: 2,81 2,82.5
N$201
  Bottom 0.25: 2.5,80.5 4,80.5
N$202
  Bottom 0.25: 2,80 2,78.5
N$203
  Bottom 0.25: 1.5,80.5 0,80.5
N$204
  Bottom 0.25: 2,45 2,46.5
N$205
  Bottom 0.25: 2.5,44.5 4,44.5
N$206
  Bottom 0.25: 2,44 2,42.5
N$207
  Bottom 0.25: 1.5,44.5 0,44.5
N$208
  Bottom 0.25: 83,45 83,46.5
N$209
  Bottom 0.25: 83.5,44.5 85,44.5
N$210
  Bottom 0.25: 83,44 83,42.5
N$211
  Bottom 0.25: 82.5,44.5 81,44.5
N$212
  Bottom 0.25: 83,81 83,82.5
N$213
  Bottom 0.25: 83.5,80.5 85,80.5
N$214
  Bottom 0.25: 83,80 83,78.5
N$215
  Bottom 0.25: 82.5,80.5 81,80.5
N$261
  Top 0.25: U20.1 38.75,14.75 39,14.5 | 39,14.5 R170.1 | R169.2 34,14 34.5,14.5 39,14.5
N$262
  Top 0.25: U20.2 39.25,16.45 41.5,14.2 R172.1 41.5,12 36.5,12 R171.2
N$263
  Top 0.25: U20.5 40.75,18.7 44.48,14.97 44.48,12.97 R174.1 44.5,12 49.5,12 R173.2
N$264
  Top 0.25: U20.6 41.25,18.89 45.64,14.5 47,14.5 | 47,14.5 51.5,14.5 52,14 R175.2 | R176.1 47,14.5
N$265
  Top 0.25: FAULT6.C 51.45,17.45 52,18 53,18 53.45,18.45 R182.1
N$266
  Top 0.25: Q21.3 R182.2
N$267
  Top 0.25: R187.1 44.5,16.5 42,19 U20.7
N$270
  Top 0.25: 2,38.5 2,40
N$271
  Top 0.25: 1.5,38 0,38
N$272
  Top 0.25: 2,37.5 2,36
N$273
  Top 0.25: 2.5,38 4,38
N$274
  Top 0.25: 83,38.5 83,40
N$275
  Top 0.25: 82.5,38 81,38
N$276
  Top 0.25: 83,37.5 83,36
N$277
  Top 0.25: 83.5,38 85,38
N$278
  Top 0.25: 83,2.5 83,4
N$279
  Top 0.25: 82.5,2 81,2
N$280
  Top 0.25: 83,1.5 83,0
N$281
  Top 0.25: 83.5,2 85,2
N$282
  Top 0.25: 2,2.5 2,4
N$283
  Top 0.25: 1.5,2 0,2
N$284
  Top 0.25: 2,1.5 2,0
N$285
  Top 0.25: 2.5,2 4,2
N$286
  Bottom 0.25: 2,38.5 2,40
N$287
  Bottom 0.25: 2.5,38 4,38
N$288
  Bottom 0.25: 2,37.5 2,36
N$289
  Bottom 0.25: 1.5,38 0,38
N$290
  Bottom 0.25: 2,2.5 2,4
N$291
  Bottom 0.25: 2.5,2 4,2
N$292
  Bottom 0.25: 2,1.5 2,0
N$293
  Bottom 0.25: 1.5,2 0,2
N$294
  Bottom 0.25: 83,2.5 83,4
N$295
  Bottom 0.25: 83.5,2 85,2
N$296
  Bottom 0.25: 83,1.5 83,0
N$297
  Bottom 0.25: 82.5,2 81,2
N$298
  Bottom 0.25: 83,38.5 83,40
N$299
  Bottom 0.25: 83.5,38 85,38
N$300
  Bottom 0.25: 83,37.5 83,36
N$301
  Bottom 0.25: 82.5,38 81,38
P14  (3 unrouted)
  Top 0.25: U1.14 75.41,150.2 80.64,155.44 80.64,161.79 SV2.10 | U9.14 75.41,107.7 80.64,112.94 80.64,119.29 SV6.10 | U15.14 75.41,65.2 80.64,70.44 80.64,76.79 SV10.10 | U21.14 75.41,22.7 80.64,27.94 80.64,34.29 SV14.10
P15  (3 unrouted)
  Top 0.25: U1.15 75.25,151 79.38,155.12 SV2.9 | U9.15 75.25,108.5 79.38,112.62 SV6.9 | U15.15 75.25,66 79.38,70.12 SV10.9 | U21.15 75.25,23.5 79.38,27.62 SV14.9
P16  (3 unrouted)
  Top 0.25: U1.16 75.1,151.8 78.11,154.81 78.11,161.79 SV2.8 | U9.16 75.1,109.3 78.11,112.31 78.11,119.29 SV6.8 | U15.16 75.1,66.8 78.11,69.81 78.11,76.79 SV10.8 | U21.16 75.1,24.3 78.11,27.31 78.11,34.29 SV14.8
P17  (3 unrouted)
  Top 0.25: U1.17 72.3,154.72 76.83,159.25 SV2.7 | U9.17 72.3,112.22 76.83,116.75 SV6.7 | U15.17 72.3,69.72 76.83,74.25 SV10.7 | U21.17 72.3,27.22 76.83,31.75 SV14.7
P18  (3 unrouted)
  Top 0.25: U1.18 71.5,154.87 75.56,158.93 75.56,161.79 SV2.6 | U9.18 71.5,112.37 75.56,116.43 75.56,119.29 SV6.6 | U15.18 71.5,69.87 75.56,73.93 75.56,76.79 SV10.6 | U21.18 71.5,27.37 75.56,31.43 75.56,34.29 SV14.6
P19  (3 unrouted)
  Top 0.25: U1.19 70.7,155.02 74.3,158.62 SV2.5 | U9.19 70.7,112.52 74.3,116.11 SV6.5 | U15.19 70.7,70.02 74.3,73.62 SV10.5 | U21.19 70.7,27.52 74.3,31.11 SV14.5
P20  (3 unrouted)
  Top 0.25: U1.20 69.9,155.17 73.03,158.3 73.03,161.79 SV2.4 | U9.20 69.9,112.67 73.03,115.8 73.03,119.29 SV6.4 | U15.20 69.9,70.17 73.03,73.3 73.03,76.79 SV10.4 | U21.20 69.9,27.67 73.03,30.8 73.03,34.29 SV14.4
P21  (3 unrouted)
  Top 0.25: U1.21 69.1,155.32 71.75,157.98 SV2.3 | U9.21 69.1,112.83 71.75,115.48 SV6.3 | U15.21 69.1,70.33 71.75,72.98 SV10.3 | U21.21 69.1,27.83 71.75,30.48 SV14.3
P22  (3 unrouted)
  Top 0.25: U1.22 68.3,155.48 70.48,157.66 70.48,161.79 SV2.2 | U9.22 68.3,112.98 70.48,115.16 70.48,119.29 SV6.2 | U15.22 68.3,70.48 70.48,72.66 70.48,76.79 SV10.2 | U21.22 68.3,27.98 70.48,30.16 70.48,34.29 SV14.2
RESET  (3 unrouted)
  Top 0.25: U1.26 62.5,151 | 61.99,143.5 61.99,140.99 66.02,136.96 66.02,135.8 66.83,135 72,135 72.54,135.54 JTAG.10 | 61.99,143.5 61.99,148.99 62.5,149.5 62.5,151 | RESET.1 62.5,151 | R8.1 61.99,143.5 | U9.26 62.5,108.5 | 61.99,101 61.99,98.49 66.02,94.46 66.02,93.3 66.83,92.5 72,92.5 72.54,93.04 JTAG2.10 | 61.99,101 61.99,106.49 62.5,107 62.5,108.5 | RESET2.1 62.5,108.5 | R68.1 61.99,101 | U15.26 62.5,66 | 61.99,58.5 61.99,55.99 66.02,51.96 66.02,50.8 66.83,50 72,50 72.54,50.54 JTAG4.10 | 61.99,58.5 61.99,63.99 62.5,64.5 62.5,66 | RESET4.1 62.5,66 | R128.1 61.99,58.5 | U21.26 62.5,23.5 | 61.99,16 61.99,13.49 66.02,9.46 66.02,8.3 66.83,7.5 72,7.5 72.54,8.04 JTAG6.10 | 61.99,16 61.99,21.49 62.5,22 62.5,23.5 | RESET6.1 62.5,23.5 | R188.1 61.99,16
S1S2  (3 unrouted)
  Top 0.61: Q1.1 20.59,146.41 21,146 23.14,146 Q1.3 23.14,145.37 24.5,144 D2.C 27.05,144 R310.1 | Q7.1 20.59,103.91 21,103.5 23.14,103.5 Q7.3 23.14,102.86 24.5,101.5 D3.C 27.05,101.5 R59.1 | Q13.1 20.59,61.41 21,61 23.14,61 Q13.3 23.14,60.36 24.5,59 D5.C 27.05,59 R119.1 | Q19.1 20.59,18.91 21,18.5 23.14,18.5 Q19.3 23.14,17.86 24.5,16.5 D7.C 27.05,16.5 R179.1
S3S4  (3 unrouted)
  Top 0.61: Q2.3 21.86,163.37 22,163.5 24,163.5 24.41,163.09 Q2.1 | Q8.3 21.86,120.86 22,121 24,121 24.41,120.59 Q8.1 | Q14.3 21.86,78.37 22,78.5 24,78.5 24.41,78.09 Q14.1 | Q20.3 21.86,35.86 22,36 24,36 24.41,35.59 Q20.1
SAFE_PWR_EN  (via drill 0.35)  (3 unrouted)
  Top 0.25: U3.4 40.25,145.25 v41.5,144 | R320.2 v31,161 | U8.4 40.25,102.75 v41.5,101.5 | R60.2 v31,118.5 | U14.4 40.25,60.25 v41.5,59 | R120.2 v31,76 | U20.4 40.25,17.75 v41.5,16.5 | R180.2 v31,33.5
  Bottom 0.25: v41.5,144 44,144 45.5,145.5 45.5,155 44.25,156.25 36.75,156.25 32,161 v31,161 | v41.5,101.5 44,101.5 45.5,103 45.5,112.5 44.25,113.75 36.75,113.75 32,118.5 v31,118.5 | v41.5,59 44,59 45.5,60.5 45.5,70 44.25,71.25 36.75,71.25 32,76 v31,76 | v41.5,16.5 44,16.5 45.5,18 45.5,27.5 44.25,28.75 36.75,28.75 32,33.5 v31,33.5
SCL  (3 unrouted)
  Top 0.25: U3.13 41.25,152.25 43.45,154.45 53,154.45 53.45,154 R5.2 R12.2 | U8.13 41.25,109.75 43.45,111.95 53,111.95 53.45,111.5 R65.2 R72.2 | U14.13 41.25,67.25 43.45,69.45 53,69.45 53.45,69 R125.2 R132.2 | U20.13 41.25,24.75 43.45,26.95 53,26.95 53.45,26.5 R185.2 R192.2
SDA  (3 unrouted)
  Top 0.25: U3.12 42,152.25 43.75,154 52,154 52.5,153.5 52.5,150 R4.2 R13.2 | U8.12 42,109.75 43.75,111.5 52,111.5 52.5,111 52.5,107.5 R64.2 R73.2 | U14.12 42,67.25 43.75,69 52,69 52.5,68.5 52.5,65 R124.2 R133.2 | U20.12 42,24.75 43.75,26.5 52,26.5 52.5,26 52.5,22.5 R184.2 R193.2
SWCLK  (3 unrouted)
  Top 0.25: U1.31 64.33,147 62.44,145.12 62.44,141.18 66.5,137.12 66.5,135.96 66.96,135.5 68.5,135.5 68.73,135.73 JTAG.4 68.73,139.5 R17.1 | U9.31 64.33,104.5 62.44,102.62 62.44,98.68 66.5,94.62 66.5,93.46 66.96,93 68.5,93 68.73,93.23 JTAG2.4 68.73,97 R77.1 | U15.31 64.33,62 62.44,60.12 62.44,56.18 66.5,52.12 66.5,50.96 66.96,50.5 68.5,50.5 68.73,50.73 JTAG4.4 68.73,54.5 R137.1 | U21.31 64.33,19.5 62.44,17.62 62.44,13.68 66.5,9.62 66.5,8.46 66.96,8 68.5,8 68.73,8.23 JTAG6.4 68.73,12 R197.1
SWDIO  (3 unrouted)
  Top 0.25: JTAG.2 67.46,138.04 67,138.5 65.76,138.5 62.89,141.37 62.89,144.93 64.16,146.2 U1.32 | JTAG2.2 67.46,95.54 67,96 65.76,96 62.89,98.87 62.89,102.43 64.16,103.7 U9.32 | JTAG4.2 67.46,53.04 67,53.5 65.76,53.5 62.89,56.37 62.89,59.93 64.16,61.2 U15.32 | JTAG6.2 67.46,10.54 67,11 65.76,11 62.89,13.87 62.89,17.43 64.16,18.7 U21.32
SWO  (3 unrouted)
USB_D_N  (3 unrouted)
  Top 0.25: J5.A7 42.25,161.5 43.25,161.5 | 43.25,161.5 J5.B7 | 43.25,161.5 43.25,162.25 43.5,162.5 49.5,162.5 54.5,157.5 R9.1 | J2.A7 42.25,119 43.25,119 | 43.25,119 J2.B7 | 43.25,119 43.25,119.75 43.5,120 49.5,120 54.5,115 R70.1 | J4.A7 42.25,76.5 43.25,76.5 | 43.25,76.5 J4.B7 | 43.25,76.5 43.25,77.25 43.5,77.5 49.5,77.5 54.5,72.5 R130.1 | J7.A7 42.25,34 43.25,34 | 43.25,34 J7.B7 | 43.25,34 43.25,34.75 43.5,35 49.5,35 54.5,30 R190.1
USB_D_P  (3 unrouted)
  Top 0.25: R10.1 53.14,159.5 49.64,163 43,163 41.75,161.75 J5.B6 41.75,158 42.75,158 J5.A6 | R71.1 53.14,117 49.64,120.5 43,120.5 41.75,119.25 J2.B6 41.75,115.5 42.75,115.5 J2.A6 | R131.1 53.14,74.5 49.64,78 43,78 41.75,76.75 J4.B6 41.75,73 42.75,73 J4.A6 | R191.1 53.14,32 49.64,35.5 43,35.5 41.75,34.25 J7.B6 41.75,30.5 42.75,30.5 J7.A6
VBUS  (via drill 0.5)  (3 unrouted)
  Top 0.25: U3.18 38.75,152.25 38,153 v38,157.5 | FAULT.A 54.5,144 57,146.5 57,153.5 56.5,154 54.5,154 53.5,155 48,155 47,156 v47,157.5 | U8.18 38.75,109.75 38,110.5 v38,115 | FAULT2.A 54.5,101.5 57,104 57,111 56.5,111.5 54.5,111.5 53.5,112.5 48,112.5 47,113.5 v47,115 | U14.18 38.75,67.25 38,68 v38,72.5 | FAULT4.A 54.5,59 57,61.5 57,68.5 56.5,69 54.5,69 53.5,70 48,70 47,71 v47,72.5 | U20.18 38.75,24.75 38,25.5 v38,30 | FAULT6.A 54.5,16.5 57,19 57,26 56.5,26.5 54.5,26.5 53.5,27.5 48,27.5 47,28.5 v47,30
  Top 0.406: R321.1 28.95,164.55 28.5,165 26,165 25.25,164.25 21.25,164.25 18.5,161.5 SV1.4 | R61.1 28.95,122.05 28.5,122.5 26,122.5 25.25,121.75 21.25,121.75 18.5,119 SV5.4 | R121.1 28.95,79.55 28.5,80 26,80 25.25,79.25 21.25,79.25 18.5,76.5 SV9.4 | R181.1 28.95,37.05 28.5,37.5 26,37.5 25.25,36.75 21.25,36.75 18.5,34 SV13.4
  Top 0.61: J5.B4_A9 40.1,159.6 | J5.A4_B9 44.9,159.1 46.5,157.5 v47,157.5 | J2.B4_A9 40.1,117.1 | J2.A4_B9 44.9,116.6 46.5,115 v47,115 | J4.B4_A9 40.1,74.6 | J4.A4_B9 44.9,74.1 46.5,72.5 v47,72.5 | J7.B4_A9 40.1,32.1 | J7.A4_B9 44.9,31.6 46.5,30 v47,30 | Q1.6 Q2.7 Q2.8 Q1.5 Q1.6 | Q7.6 Q8.7 Q8.8 Q7.5 Q7.6 | Q13.6 Q14.7 Q14.8 Q13.5 Q13.6 | Q19.6 Q20.7 Q20.8 Q19.5 Q19.6
  Bottom 1.016: v38,157.5 v47,157.5 | v38,115 v47,115 | v38,72.5 v47,72.5 | v38,30 v47,30
  pour Top: 22.75,159 22.75,150.5 28,150.5 28,145.5 30.5,145.5 30.5,152.5 34.5,156.5 40,156.5 40.5,157 40.5,163.5 28,163.5 28,159
  pour Top: 22.75,116.5 22.75,108 28,108 28,103 30.5,103 30.5,110 34.5,114 40,114 40.5,114.5 40.5,121 28,121 28,116.5
  pour Top: 22.75,74 22.75,65.5 28,65.5 28,60.5 30.5,60.5 30.5,67.5 34.5,71.5 40,71.5 40.5,72 40.5,78.5 28,78.5 28,74
  pour Top: 22.75,31.5 22.75,23 28,23 28,18 30.5,18 30.5,25 34.5,29 40,29 40.5,29.5 40.5,36 28,36 28,31.5
VBUS_FET_EN  (3 unrouted)
  Top 0.25: U3.3 39.75,144.25 41.5,142.5 42.5,142.5 43,142 43,137.5 40.5,135 32.25,135 29.73,137.53 27.52,137.53 27.05,138 R311.2 | U8.3 39.75,101.75 41.5,100 42.5,100 43,99.5 43,95 40.5,92.5 32.25,92.5 29.73,95.03 27.52,95.03 27.05,95.5 R57.2 | U14.3 39.75,59.25 41.5,57.5 42.5,57.5 43,57 43,52.5 40.5,50 32.25,50 29.73,52.53 27.52,52.53 27.05,53 R117.2 | U20.3 39.75,16.75 41.5,15 42.5,15 43,14.5 43,10 40.5,7.5 32.25,7.5 29.73,10.03 27.52,10.03 27.05,10.5 R177.2
VCCD  (3 unrouted)
  Top 0.25: C304.1 35.5,144 36.5,145 TP6.TP 38,145.75 U3.24 | C29.1 35.5,101.5 36.5,102.5 TP22.TP 38,103.25 U8.24 | C55.1 35.5,59 36.5,60 TP38.TP 38,60.75 U14.24 | C81.1 35.5,16.5 36.5,17.5 TP54.TP 38,18.25 U20.24
VDDCORE  (3 unrouted)
  Top 0.25: C6.1 63.55,148.6 U1.29 | C32.1 63.55,106.1 U9.29 | C58.1 63.55,63.6 U15.29 | C84.1 63.55,21.1 U21.29
VDDD  (3 unrouted)
  Top 0.25: C302.1 35.75,149 36.5,148.25 U3.23 | C303.1 TP5.TP | C27.1 35.75,106.5 36.5,105.75 U8.23 | C28.1 TP21.TP | C53.1 35.75,64 36.5,63.25 U14.23 | C54.1 TP37.TP | C79.1 35.75,21.5 36.5,20.75 U20.23 | C80.1 TP53.TP
  Top 0.61: C301.1 C302.1 C303.1 | C26.1 C27.1 C28.1 | C52.1 C53.1 C54.1 | C78.1 C79.1 C80.1
VDDOUT  (via drill 0.35)  (3 unrouted)
  Top 0.25: U3.11 43.11,149.75 43.55,150.19 43.55,152.05 v44,152.5 | U8.11 43.11,107.25 43.55,107.69 43.55,109.55 v44,110 | U14.11 43.11,64.75 43.55,65.19 43.55,67.05 v44,67.5 | U20.11 43.11,22.25 43.55,22.69 43.55,24.55 v44,25
  Top 0.61: Q1.8 Q2.5 Q2.6 Q1.7 Q1.8 | Q7.8 Q8.5 Q8.6 Q7.7 Q7.8 | Q13.8 Q14.5 Q14.6 Q13.7 Q13.8 | Q19.8 Q20.5 Q20.6 Q19.7 Q19.8
  Bottom 0.25: v44,152.5 42.75,153.75 37.5,153.75 36.5,154.75 TP2.TP | v44,110 42.75,111.25 37.5,111.25 36.5,112.25 TP18.TP | v44,67.5 42.75,68.75 37.5,68.75 36.5,69.75 TP34.TP | v44,25 42.75,26.25 37.5,26.25 36.5,27.25 TP50.TP
  other vias: 16.5,154.75 16.5,112.25 16.5,69.75 16.5,27.25
  pour Top: 22.25,159 22.25,150.5 12,150.5 12,159 15,162 20,162 20,159
  pour Top: 22.25,116.5 22.25,108 12,108 12,116.5 15,119.5 20,119.5 20,116.5
  pour Top: 22.25,74 22.25,65.5 12,65.5 12,74 15,77 20,77 20,74
  pour Top: 22.25,31.5 22.25,23 12,23 12,31.5 15,34.5 20,34.5 20,31.5
(copper drawn outside any net)
  shapes: Bottom circle x16, Top circle x16

## Text on the board
tNames: SWDIO | SWCLK | SWO | NC | RESET | VCC | GND | GND | KEY | DTCT | SWDIO | SWCLK | SWO | NC | RESET | VCC | GND | GND | KEY | DTCT | SWDIO | SWCLK | SWO | NC | RESET | VCC | GND | GND | KEY | DTCT | SWDIO | SWCLK | SWO | NC | RESET | VCC | GND | GND | KEY | DTCT